# EAGLE board UhrV1.1 (EAGLE 5.11), part 1 of 2
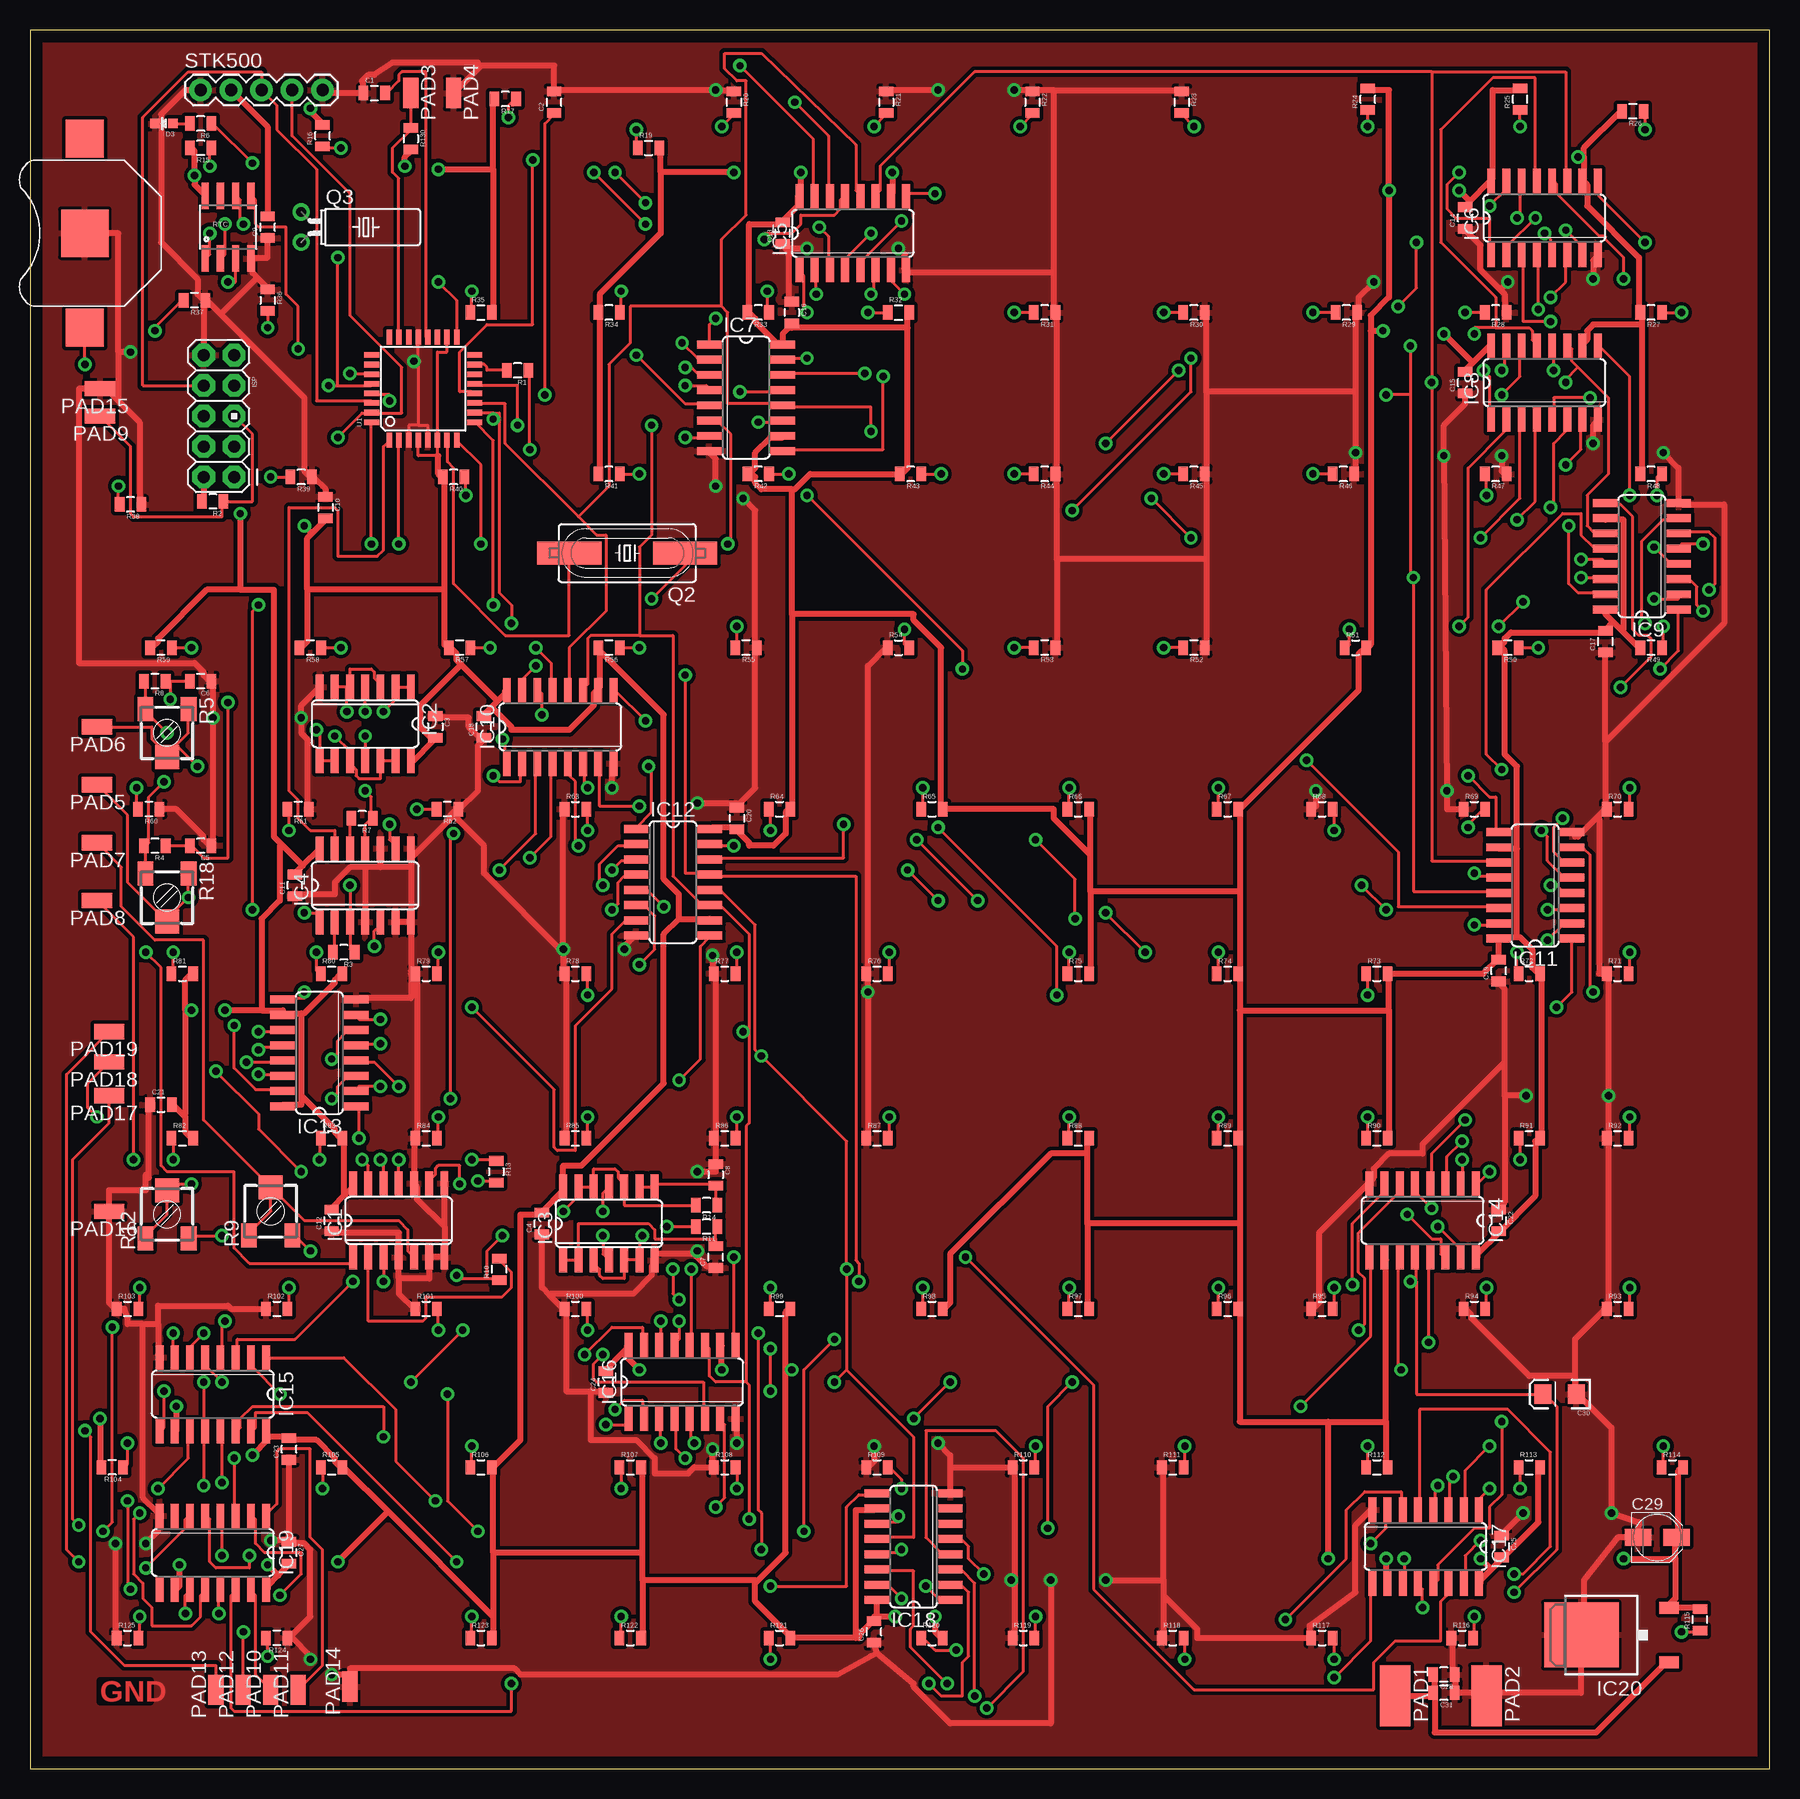
[diagram p3: board, top side]
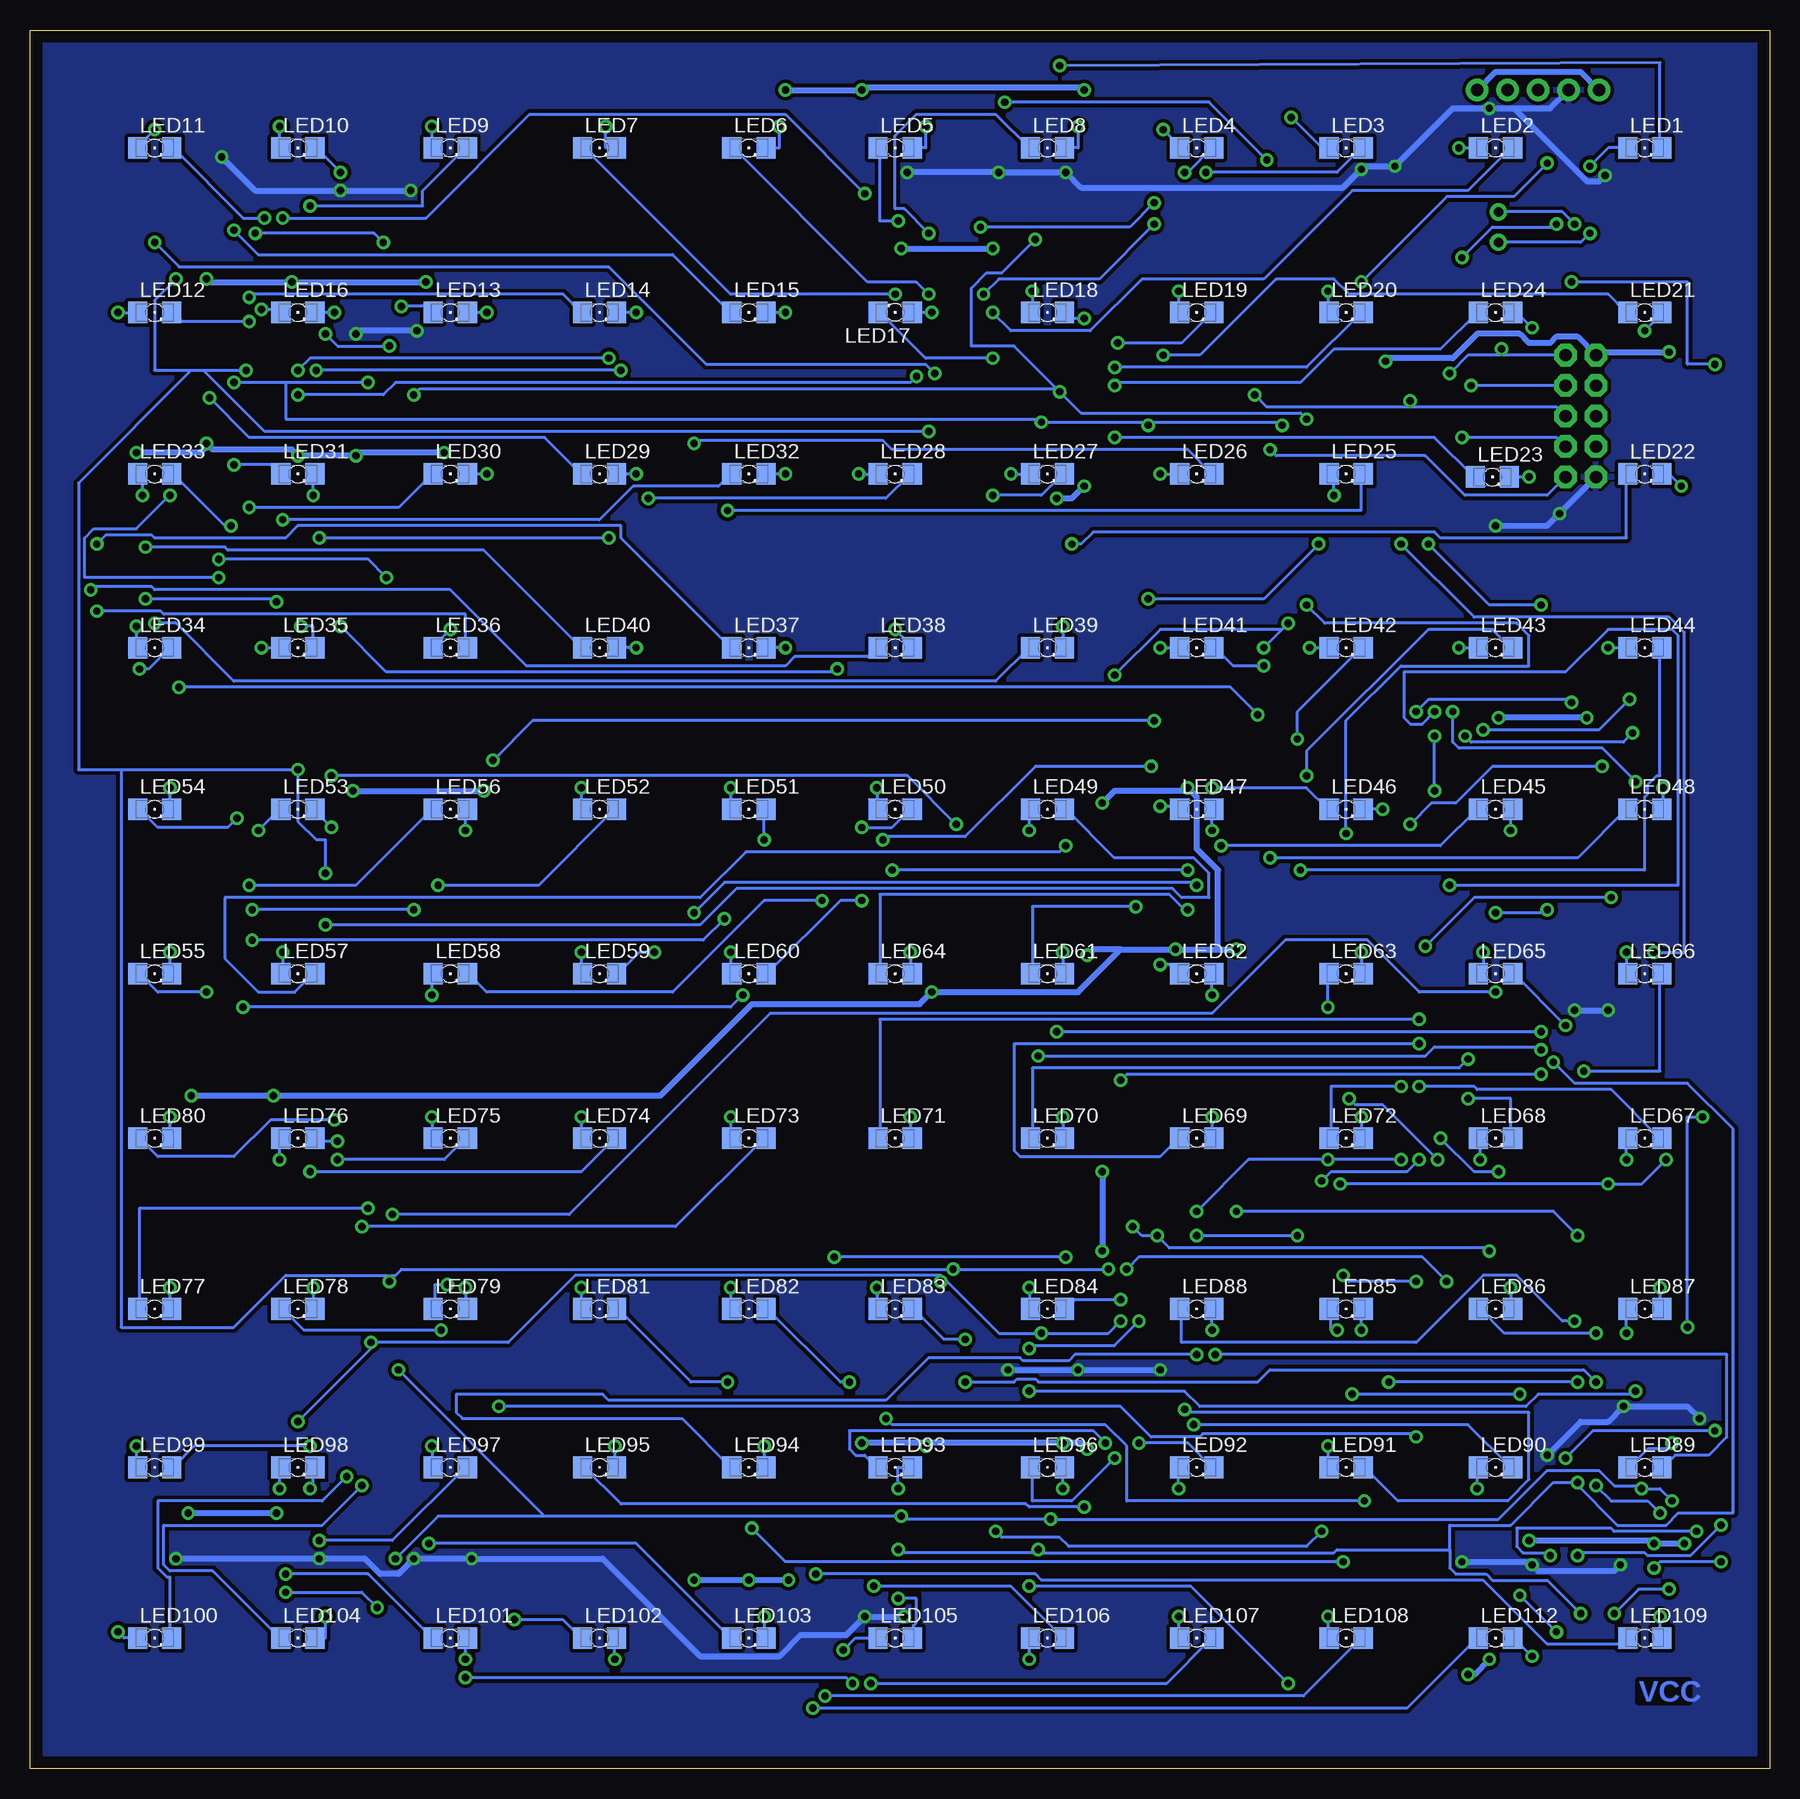
[diagram p4: board, bottom side, seen from below]

Size 145.01 x 144.96 mm. Coordinates in mm from the lower left corner, seen from the top.
Outline: 0,0 145.01,0 145.01,144.96 0,144.96 0,0
Copper layers (1*16): Top 0.035mm / dielectric 1.5mm / Bottom 0.035mm
Design rules "default *": minimum track width 10mil, minimum drill 24mil, track to track 10mil, track to pad 10mil, pad to pad 10mil, via to via 10mil, smd to smd 10mil, copper to edge 40mil, drill to drill 8mil, minimum pad ring 12mil, minimum via ring 10mil, stop-mask expansion 4mil, vias tented up to drill 0mil, thermal gap 10mil
Net classes: 1 supply: width 0.508 mm

## Footprints (pad centres in the part's own frame; a part is rotated, then mirrored left to right if it is on the bottom)
BATTCON_12MM = smd 3.962 x 3.962: GND 0,0 | smd 3.175 x 3.175: PWR@1 -7.874,0; PWR@2 7.874,0
0805 = smd 0.8 x 1.2: 1 -0.9,0; 2 0.9,0
PANASONIC_B = smd 2.2 x 1.4: + 1.6,0; - -1.6,0
EIA3216 = smd 1.4 x 1.6: A 1.4,0; C -1.4,0
LED-0603 = smd 0.8 x 0.8: A 0,-0.75; C 0,0.75
SO14 = smd 0.66 x 2.032: 1 -3.81,-3.073; 2 -2.54,-3.073; 3 -1.27,-3.073; 4 0,-3.073; 5 1.27,-3.073; 6 2.54,-3.073; 7 3.81,-3.073; 8 3.81,3.073; 9 2.54,3.073; 10 1.27,3.073; 11 0,3.073; 12 -1.27,3.073; 13 -2.54,3.073; 14 -3.81,3.073
SO16 = smd 0.66 x 2.032: 1 -4.445,-3.073; 2 -3.175,-3.073; 3 -1.905,-3.073; 4 -0.635,-3.073; 5 0.635,-3.073; 6 1.905,-3.073; 7 3.175,-3.073; 8 4.445,-3.073; 9 4.445,3.073; 10 3.175,3.073; 11 1.905,3.073; 12 0.635,3.073; 13 -0.635,3.073; 14 -1.905,3.073; 15 -3.175,3.073; 16 -4.445,3.073
DPACK = smd 1 x 1.6: 1 -2.28,-4.8; 3 2.28,-4.8 | smd 5.4 x 6.2: 2 0,2.5
AVR_ICSP = drill 1.016 pad 1.88 octagon: 1 -1.27,5.08; 2 1.27,5.08; 3 -1.27,2.54; 4 1.27,2.54; 5 -1.27,0; 6 1.27,0; 7 -1.27,-2.54; 8 1.27,-2.54; 9 -1.27,-5.08; 10 1.27,-5.08
1206 = smd 1.6 x 1.803: A -1.422,0; C 1.422,0
SMD2,54-5,08 = smd 2.54 x 5.08: 1 0,0
SMD1,27-2,54 = smd 1.27 x 2.54: 1 0,0
HC49UP = smd 5.334 x 1.93: 1 -4.826,0; 2 4.826,0
TC38H = drill 0.813 round: 1 -1.27,0; 2 1.27,0
RTRIM3314J = smd 1.3 x 2: 1 -1.8,-2; 3 1.8,-2 | smd 2 x 2: 2 0,2
SO08 = smd 0.61 x 2.21: 1 -1.905,-2.616; 2 -0.635,-2.616; 3 0.635,-2.616; 4 1.905,-2.616; 5 1.905,2.616; 6 0.635,2.616; 7 -0.635,2.616; 8 -1.905,2.616
1X05 = drill 1.016 pad 1.88 round: 1 0,0; 2 2.54,0; 3 5.08,0; 4 7.62,0; 5 10.16,0
TQFP32-08 = smd 1.27 x 0.46: 1 -4.293,2.8; 2 -4.293,2; 3 -4.293,1.2; 4 -4.293,0.4; 5 -4.293,-0.4; 6 -4.293,-1.2; 7 -4.293,-2; 8 -4.293,-2.8; 17 4.293,-2.8; 18 4.293,-2; 19 4.293,-1.2; 20 4.293,-0.4; 21 4.293,0.4; 22 4.293,1.2; 23 4.293,2; 24 4.293,2.8 | smd 0.46 x 1.27: 9 -2.8,-4.293; 10 -2,-4.293; 11 -1.2,-4.293; 12 -0.4,-4.293; 13 0.4,-4.293; 14 1.2,-4.293; 15 2,-4.293; 16 2.8,-4.293; 25 2.8,4.293; 26 2,4.293; 27 1.2,4.293; 28 0.4,4.293; 29 -0.4,4.293; 30 -1.2,4.293; 31 -2,4.293; 32 -2.8,4.293

## Placement (x,y rotation side)
BAT1  [BATTCON_12MM]  4.57,128.02 90 top
C1  0.1uF  [0805]  28.7,139.7 0 top
C2  0.1uF  [0805]  43.69,138.94 90 top
C3  0.1uF  [0805]  33.78,86.87 270 top
C4  0.1uF  [0805]  42.67,45.47 90 top
C5  3,3nF  [0805]  14.22,76.96 180 top
C6  3,3nF  [0805]  14.22,90.68 180 top
C7  3,3nF  [0805]  57.15,42.67 90 top
C8  3,3nF  [0805]  57.15,49.53 270 top
C9  0.1uF  [0805]  19.81,128.52 90 top
C10  0.1uF  [0805]  24.64,105.16 270 top
C11  0.1uF  [0805]  22.1,73.66 90 top
C12  0.1uF  [0805]  25.15,45.72 90 top
C13  0.1uF  [0805]  62.74,128.02 90 top
C14  0.1uF  [0805]  119.63,129.29 90 top
C15  0.1uF  [0805]  119.63,115.57 90 top
C16  0.1uF  [0805]  63.5,121.41 270 top
C17  0.1uF  [0805]  131.32,93.98 90 top
C18  0.1uF  [0805]  37.85,86.87 90 top
C19  0.1uF  [0805]  122.43,66.55 90 top
C20  0.1uF  [0805]  58.93,79.25 270 top
C21  0.1uF  [0805]  10.92,55.37 0 top
C22  0.1uF  [0805]  122.43,45.72 270 top
C23  0.1uF  [0805]  21.59,26.67 90 top
C24  0.1uF  [0805]  48.01,32.26 90 top
C25  0.1uF  [0805]  122.68,18.54 270 top
C26  0.1uF  [0805]  70.36,11.43 90 top
C27  0.1uF  [0805]  21.59,18.03 270 top
C28  0.1uF  [0805]  117.86,7.87 180 top
C29  10uF  [PANASONIC_B]  135.64,19.3 0 top
C30  1uF  [EIA3216]  127.51,31.24 180 top
C31  0.1uF  [0805]  117.86,6.35 180 top
D3  Green  [LED-0603]  11.18,137.16 90 top
IC1  4013D  [SO14]  30.73,45.72 0 top
IC2  4093D  [SO14]  27.94,87.12 180 top
IC3  4093D  [SO14]  48.26,45.47 0 top
IC4  4013D  [SO14]  27.94,73.66 0 top
IC5  74HC595D  [SO16]  68.58,128.02 0 top
IC6  74HC595D  [SO16]  126.24,129.29 0 top
IC7  74HC595D  [SO16]  59.69,114.3 270 top
IC8  74HC595D  [SO16]  126.24,115.57 0 top
IC9  74HC595D  [SO16]  134.37,101.09 90 top
IC10  74HC595D  [SO16]  44.2,86.87 0 top
IC11  74HC595D  [SO16]  125.48,73.66 90 top
IC12  74HC595D  [SO16]  53.59,73.91 270 top
IC13  74HC595D  [SO16]  24.13,59.69 90 top
IC14  74HC595D  [SO16]  116.08,45.72 180 top
IC15  74HC595D  [SO16]  15.24,31.24 180 top
IC16  74HC595D  [SO16]  54.36,32.26 0 top
IC17  74HC595D  [SO16]  116.33,18.54 180 top
IC18  74HC595D  [SO16]  73.66,18.54 90 top
IC19  74HC595D  [SO16]  15.24,18.03 180 top
IC20  LP2950  [DPACK]  131.83,11.18 90 top
ISP  M05X2PTH  [AVR_ICSP]  15.75,112.78 180 top
LED1  [1206]  10.41,135.13 0 bottom
LED2  [1206]  22.86,135.13 0 bottom
LED3  [1206]  35.31,135.13 0 bottom
LED4  [1206]  47.75,135.13 0 bottom
LED5  [1206]  72.9,135.13 0 bottom
LED6  [1206]  85.09,135.13 0 bottom
LED7  [1206]  97.54,135.13 0 bottom
LED8  [1206]  60.2,135.13 0 bottom
LED9  [1206]  109.98,135.13 0 bottom
LED10  [1206]  122.68,135.13 0 bottom
LED11  [1206]  134.62,135.13 0 bottom
LED12  [1206]  134.62,121.41 0 bottom
LED13  [1206]  109.98,121.41 0 bottom
LED14  [1206]  97.54,121.41 0 bottom
LED15  [1206]  85.09,121.41 0 bottom
LED16  [1206]  122.68,121.41 0 bottom
LED17  [1206]  72.9,121.41 180 bottom
LED18  [1206]  60.2,121.41 0 bottom
LED19  [1206]  47.75,121.41 0 bottom
LED20  [1206]  35.31,121.41 0 bottom
LED21  [1206]  10.41,121.41 0 bottom
LED22  [1206]  10.41,107.95 0 bottom
LED23  [1206]  23.11,107.7 0 bottom
LED24  [1206]  22.86,121.41 0 bottom
LED25  [1206]  35.31,107.95 0 bottom
LED26  [1206]  47.75,107.95 0 bottom
LED27  [1206]  60.2,107.95 0 bottom
LED28  [1206]  72.9,107.95 0 bottom
LED29  [1206]  97.54,107.95 0 bottom
LED30  [1206]  109.98,107.95 0 bottom
LED31  [1206]  122.68,107.95 0 bottom
LED32  [1206]  85.09,107.95 0 bottom
LED33  [1206]  134.62,107.95 0 bottom
LED34  [1206]  134.62,93.47 0 bottom
LED35  [1206]  122.68,93.47 0 bottom
LED36  [1206]  109.98,93.47 0 bottom
LED37  [1206]  85.09,93.47 0 bottom
LED38  [1206]  72.9,93.47 0 bottom
LED39  [1206]  60.2,93.47 0 bottom
LED40  [1206]  97.54,93.47 0 bottom
LED41  [1206]  47.75,93.47 0 bottom
LED42  [1206]  35.31,93.47 0 bottom
LED43  [1206]  22.86,93.47 0 bottom
LED44  [1206]  10.41,93.47 0 bottom
LED45  [1206]  22.86,80.01 0 bottom
LED46  [1206]  35.31,80.01 0 bottom
LED47  [1206]  47.75,80.01 0 bottom
LED48  [1206]  10.41,80.01 0 bottom
LED49  [1206]  60.2,80.01 0 bottom
LED50  [1206]  72.9,80.01 0 bottom
LED51  [1206]  85.09,80.01 0 bottom
LED52  [1206]  97.54,80.01 0 bottom
LED53  [1206]  122.68,80.01 0 bottom
LED54  [1206]  134.62,80.01 0 bottom
LED55  [1206]  134.62,66.29 0 bottom
LED56  [1206]  109.98,80.01 0 bottom
LED57  [1206]  122.68,66.29 0 bottom
LED58  [1206]  109.98,66.29 0 bottom
LED59  [1206]  97.54,66.29 0 bottom
LED60  [1206]  85.09,66.29 0 bottom
LED61  [1206]  60.2,66.29 0 bottom
LED62  [1206]  47.75,66.29 0 bottom
LED63  [1206]  35.31,66.29 0 bottom
LED64  [1206]  72.9,66.29 0 bottom
LED65  [1206]  22.86,66.29 0 bottom
LED66  [1206]  10.41,66.29 0 bottom
LED67  [1206]  10.41,52.58 0 bottom
LED68  [1206]  22.86,52.58 0 bottom
LED69  [1206]  47.75,52.58 0 bottom
LED70  [1206]  60.2,52.58 0 bottom
LED71  [1206]  72.9,52.58 0 bottom
LED72  [1206]  35.31,52.58 0 bottom
LED73  [1206]  85.09,52.58 0 bottom
LED74  [1206]  97.54,52.58 0 bottom
LED75  [1206]  109.98,52.58 0 bottom
LED76  [1206]  122.68,52.58 0 bottom
LED77  [1206]  134.62,38.35 0 bottom
LED78  [1206]  122.68,38.35 0 bottom
LED79  [1206]  109.98,38.35 0 bottom
LED80  [1206]  134.62,52.58 0 bottom
LED81  [1206]  97.54,38.35 0 bottom
LED82  [1206]  85.09,38.35 0 bottom
LED83  [1206]  72.9,38.35 0 bottom
LED84  [1206]  60.2,38.35 0 bottom
LED85  [1206]  35.31,38.35 0 bottom
LED86  [1206]  22.86,38.35 0 bottom
LED87  [1206]  10.41,38.35 0 bottom
LED88  [1206]  47.75,38.35 0 bottom
LED89  [1206]  10.41,25.15 0 bottom
LED90  [1206]  22.86,25.15 0 bottom
LED91  [1206]  35.31,25.15 0 bottom
LED92  [1206]  47.75,25.15 0 bottom
LED93  [1206]  72.9,25.15 0 bottom
LED94  [1206]  85.09,25.15 0 bottom
LED95  [1206]  97.54,25.15 0 bottom
LED96  [1206]  60.2,25.15 0 bottom
LED97  [1206]  109.98,25.15 0 bottom
LED98  [1206]  122.68,25.15 0 bottom
LED99  [1206]  134.62,25.15 0 bottom
LED100  [1206]  134.62,10.92 0 bottom
LED101  [1206]  109.98,10.92 0 bottom
LED102  [1206]  97.54,10.92 0 bottom
LED103  [1206]  85.09,10.92 0 bottom
LED104  [1206]  122.68,10.92 0 bottom
LED105  [1206]  72.9,10.92 0 bottom
LED106  [1206]  60.2,10.92 0 bottom
LED107  [1206]  47.75,10.92 0 bottom
LED108  [1206]  35.31,10.92 0 bottom
LED109  [1206]  10.41,10.92 0 bottom
LED112  [1206]  22.86,10.92 0 bottom
PAD1  [SMD2,54-5,08]  113.79,6.1 180 top
PAD2  [SMD2,54-5,08]  121.41,6.1 180 top
PAD3  [SMD1,27-2,54]  31.75,139.7 180 top
PAD4  [SMD1,27-2,54]  35.31,139.7 180 top
PAD5  [SMD1,27-2,54]  5.59,82.04 90 top
PAD6  [SMD1,27-2,54]  5.59,86.87 90 top
PAD7  [SMD1,27-2,54]  5.59,77.22 90 top
PAD8  [SMD1,27-2,54]  5.59,72.39 90 top
PAD9  [SMD1,27-2,54]  5.84,112.78 90 top
PAD10  [SMD1,27-2,54]  20.07,6.6 0 top
PAD11  [SMD1,27-2,54]  22.35,6.6 0 top
PAD12  [SMD1,27-2,54]  17.78,6.6 0 top
PAD13  [SMD1,27-2,54]  15.49,6.6 0 top
PAD14  [SMD1,27-2,54]  26.67,6.86 0 top
PAD15  [SMD1,27-2,54]  5.84,115.06 90 top
PAD16  [SMD1,27-2,54]  6.6,46.48 90 top
PAD17  [SMD1,27-2,54]  6.6,56.13 90 top
PAD18  [SMD1,27-2,54]  6.6,58.93 90 top
PAD19  [SMD1,27-2,54]  6.6,61.47 90 top
Q2  16MHz  [HC49UP]  49.78,101.35 180 top
Q3  [TC38H]  22.61,128.52 270 top
R1  4K7  [0805]  40.64,116.59 180 top
R2  10K  [0805]  15.24,105.66 180 top
R3  4K7  [0805]  26.16,68.07 180 top
R4  33K  [0805]  10.41,76.96 180 top
R5  [RTRIM3314J]  11.43,86.36 180 top
R6  330  [0805]  14.22,137.16 180 top
R7  4K7  [0805]  27.69,79.25 180 top
R8  33K  [0805]  10.41,90.68 180 top
R9  [RTRIM3314J]  20.07,46.48 0 top
R10  4K7  [0805]  39.12,41.66 90 top
R11  33K  [0805]  56.39,45.21 180 top
R12  [RTRIM3314J]  11.43,46.23 0 top
R13  4K7  [0805]  38.86,49.78 270 top
R14  33K  [0805]  56.39,46.99 180 top
R15  120  [0805]  14.22,135.13 180 top
R16  120  [0805]  24.38,136.14 90 top
R17  120  [0805]  39.62,139.19 180 top
R18  [RTRIM3314J]  11.43,72.64 180 top
R19  120  [0805]  51.56,135.13 0 top
R20  120  [0805]  58.67,138.94 270 top
R21  120  [0805]  71.37,138.94 270 top
R22  120  [0805]  83.57,138.94 270 top
R23  120  [0805]  96.01,138.94 270 top
R24  120  [0805]  111.51,139.19 90 top
R25  120  [0805]  124.21,139.19 90 top
R26  120  [0805]  133.6,138.18 180 top
R27  120  [0805]  135.13,121.41 180 top
R28  120  [0805]  122.17,121.41 180 top
R29  120  [0805]  109.73,121.41 180 top
R30  120  [0805]  97.03,121.41 180 top
R31  120  [0805]  84.58,121.41 180 top
R32  120  [0805]  72.39,121.41 0 top
R33  120  [0805]  60.71,121.41 180 top
R34  120  [0805]  48.26,121.41 180 top
R35  120  [0805]  37.59,121.41 0 top
R36  120  [0805]  19.81,122.43 270 top
R37  120  [0805]  13.72,122.43 180 top
R38  120  [0805]  8.38,105.41 180 top
R39  120  [0805]  22.61,107.7 180 top
R40  120  [0805]  35.31,107.7 180 top
R41  120  [0805]  48.26,107.95 180 top
R42  120  [0805]  60.71,107.95 180 top
R43  120  [0805]  73.41,107.95 180 top
R44  120  [0805]  84.58,107.95 180 top
R45  120  [0805]  97.03,107.95 180 top
R46  120  [0805]  109.47,107.95 180 top
R47  120  [0805]  122.17,107.95 180 top
R48  120  [0805]  135.13,107.95 180 top
R49  120  [0805]  135.13,93.47 180 top
R50  120  [0805]  123.19,93.47 180 top
R51  120  [0805]  110.49,93.47 0 top
R52  120  [0805]  97.03,93.47 180 top
R53  120  [0805]  84.58,93.47 180 top
R54  120  [0805]  72.39,93.47 0 top
R55  120  [0805]  59.69,93.47 180 top
R56  120  [0805]  48.26,93.47 180 top
R57  120  [0805]  35.81,93.47 180 top
R58  120  [0805]  23.37,93.47 180 top
R59  120  [0805]  10.92,93.47 180 top
R60  120  [0805]  9.91,80.01 180 top
R61  120  [0805]  22.35,80.01 180 top
R62  120  [0805]  34.8,80.01 180 top
R63  120  [0805]  45.47,80.01 0 top
R64  120  [0805]  62.48,80.01 0 top
R65  120  [0805]  75.18,80.01 0 top
R66  120  [0805]  87.38,80.01 0 top
R67  120  [0805]  99.82,80.01 0 top
R68  120  [0805]  107.7,80.01 0 top
R69  120  [0805]  120.4,80.01 0 top
R70  120  [0805]  132.33,80.01 0 top
R71  120  [0805]  132.33,66.29 0 top
R72  120  [0805]  124.97,66.29 0 top
R73  120  [0805]  112.27,66.29 0 top
R74  120  [0805]  99.82,66.29 0 top
R75  120  [0805]  87.38,66.29 0 top
R76  120  [0805]  70.61,66.29 0 top
R77  120  [0805]  57.91,66.29 0 top
R78  120  [0805]  45.47,66.29 0 top
R79  120  [0805]  33.02,66.29 0 top
R80  120  [0805]  25.15,66.29 0 top
R81  120  [0805]  12.7,66.29 0 top
R82  120  [0805]  12.7,52.58 0 top
R83  120  [0805]  25.15,52.58 0 top
R84  120  [0805]  33.02,52.58 0 top
R85  120  [0805]  45.47,52.58 0 top
R86  120  [0805]  57.91,52.58 0 top
R87  120  [0805]  70.61,52.58 0 top
R88  120  [0805]  87.38,52.58 0 top
R89  120  [0805]  99.82,52.58 0 top
R90  120  [0805]  112.27,52.58 0 top
R91  120  [0805]  124.97,52.58 0 top
R92  120  [0805]  132.33,52.58 0 top
R93  120  [0805]  132.33,38.35 0 top
R94  120  [0805]  120.4,38.35 0 top
R95  120  [0805]  107.7,38.35 0 top
R96  120  [0805]  99.82,38.35 0 top
R97  120  [0805]  87.38,38.35 0 top
R98  120  [0805]  75.18,38.35 0 top
R99  120  [0805]  62.48,38.35 0 top
R100  120  [0805]  45.47,38.35 0 top
R101  120  [0805]  33.02,38.35 0 top
R102  120  [0805]  20.57,38.35 0 top
R103  120  [0805]  8.13,38.35 0 top
R104  120  [0805]  6.86,25.15 180 top
R105  120  [0805]  25.15,25.15 0 top
R106  120  [0805]  37.59,25.15 0 top
R107  120  [0805]  50.04,25.15 0 top
R108  120  [0805]  57.91,25.15 0 top
R109  120  [0805]  70.61,25.15 0 top
R110  120  [0805]  82.8,25.15 0 top
R111  120  [0805]  95.25,25.15 0 top
R112  120  [0805]  112.27,25.15 0 top
R113  120  [0805]  124.97,25.15 0 top
R114  120  [0805]  136.91,25.15 0 top
R115  120  [0805]  139.19,12.45 90 top
R116  120  [0805]  119.38,10.92 0 top
R117  120  [0805]  107.7,10.92 0 top
R118  120  [0805]  95.25,10.92 0 top
R119  120  [0805]  82.8,10.92 0 top
R120  120  [0805]  75.18,10.92 0 top
R121  120  [0805]  62.48,10.92 0 top
R122  120  [0805]  50.04,10.92 0 top
R123  120  [0805]  37.59,10.92 0 top
R124  120  [0805]  20.57,10.92 180 top
R125  120  [0805]  8.13,10.92 0 top
R130  330K  [0805]  31.75,135.89 270 top
RTC  DS1307SO8  [SO08]  16.51,128.52 0 top
STK500  [1X05]  14.22,139.95 0 top
U1  ATMEGA328  [TQFP32-08]  32.77,115.06 90 top

## Tracks (layer width: path | path; a pad name or v marks a point on that pad's centre or on a via)
A0
  Top 0.254: PAD3.1 R130.1 31.75,136.65 30.23,135.13 30.23,133.1 30.73,132.59 30.73,119.38 U1.23
AREF
  Top 0.254: C1.2 29.72,139.7 30.73,140.72 30.73,141.22 30.99,141.48 33.02,141.48 33.02,119.38 U1.20
D2  (via drill 0.61)
  Top 0.254: v28.45,102.11 28.45,112.27 U1.32 | v19.05,97.03 18.54,96.52 v18.54,71.63 | v22.86,71.37 24.13,71.37 IC4.1
  Bottom 0.254: v28.45,102.11 23.37,97.03 v19.05,97.03 | v18.54,71.63 18.8,71.37 v22.86,71.37
D3
  Top 0.254: U1.1 29.97,110.74 29.46,110.24 29.46,101.6 28.96,101.09 25.65,101.09 25.65,104.9 25.4,105.16 21.59,105.16 21.59,81.53 22.35,80.77 22.35,79.25 23.37,78.23 25.4,78.23 IC4.13
D4  (via drill 0.61)
  Top 0.254: v30.73,102.11 30.73,110.74 U1.2 | v9.65,68.07 10.92,66.8 10.92,50.29 11.43,49.78 17.02,49.78 17.02,43.43 18.29,42.16 26.92,42.16 IC1.1
  Bottom 0.254: v30.73,102.11 24.64,96.01 8.38,96.01 7.11,94.74 7.11,68.07 v9.65,68.07
D5  (via drill 0.61)
  Top 0.254: v38.61,97.03 38.61,110.74 37.08,112.27 U1.9 | v35.31,77.98 35.05,77.72 v35.05,55.88 | v27.69,50.8 28.19,50.29 IC1.13
  Bottom 0.254: v38.61,97.03 37.08,95.5 21.08,95.5 20.07,94.49 20.07,91.95 30.73,91.95 35.31,87.38 v35.31,77.98 | v35.05,55.88 34.54,55.37 32.26,55.37 v27.69,50.8
D6  (via drill 0.61)
  Top 0.254: 122.17,120.14 124.97,120.14 125.22,119.89 125.22,119.13 125.48,118.87 IC8.13 | 122.17,120.14 122.17,122.68 117.6,127.25 117.6,136.65 121.92,140.97 125.48,140.97 125.48,132.59 IC6.13 | v129.29,100.84 131.06,100.84 131.06,100.58 IC9.13 | IC11.13 122.17,73.15 115.32,73.15 v115.32,99.31 115.06,99.57 115.06,114.55 | 122.17,120.14 120.4,120.14 v120.4,119.63 | v115.06,118.62 115.06,114.55 | 38.61,113.03 39.12,113.03 39.12,98.04 40.13,97.03 v40.13,95.5 | 38.61,113.03 37.08,113.03 U1.10 | v42.16,93.47 43.43,92.2 43.43,90.17 IC10.13 | v54.61,91.19 54.61,74.68 56.64,74.68 IC12.13 56.9,74.42 68.83,74.42 68.83,42.42 69.09,42.16 v69.09,40.64 | v59.18,114.81 62.74,114.81 IC7.13 | v38.61,112.52 38.61,113.03 | v61.21,127.51 61.21,128.02 63.5,128.02 64.26,128.78 64.26,129.54 67.06,129.54 67.56,130.05 67.56,130.81 67.82,131.06 IC5.13 | 115.06,114.55 v113.03,114.55 | v15.75,12.95 15.75,14.73 IC19.13 | v16,23.88 16,27.94 IC15.13 | v72.64,18.29 72.64,18.03 70.61,18.03 IC18.13 | v18.03,58.93 20.83,58.93 IC13.13 | v54.1,37.34 54.1,35.81 53.85,35.56 IC16.13 | v60.71,36.32 60.71,21.59 60.96,21.34 v60.96,18.29 | v116.59,35.56 116.59,42.42 IC14.13 | v122.68,28.96 122.68,22.86 121.67,21.84 121.67,20.07 120.4,20.07 117.35,17.02 117.35,15.75 117.09,15.49 IC17.13
  Bottom 0.254: v115.32,99.31 116.84,100.84 v129.29,100.84 | v120.4,119.63 119.38,118.62 v115.06,118.62 | 40.64,95 v42.16,93.47 | v40.13,95.5 40.64,95 | v54.61,91.19 50.8,95 40.64,95 | v38.61,112.52 39.12,113.03 57.4,113.03 v59.18,114.81 59.44,115.06 | v61.21,127.51 64.01,124.71 65.28,124.71 66.55,123.44 66.55,118.62 62.99,118.62 59.44,115.06 | v113.03,114.55 112.52,115.06 59.44,115.06 | v15.75,12.95 18.54,15.75 23.11,15.75 23.62,16.26 26.16,16.26 26.67,16.76 26.67,18.29 | 26.67,18.29 26.67,20.32 21.59,20.32 18.03,23.88 16.26,23.88 | v72.64,18.29 72.39,18.03 60.96,18.03 | 60.96,18.03 36.32,18.03 36.07,18.29 26.67,18.29 | v18.03,58.93 16.26,57.15 6.86,57.15 3.05,53.34 3.05,21.34 7.62,21.34 8.64,20.32 12.7,20.32 16.26,23.88 | 16.26,23.88 v16,23.88 | v54.1,37.34 55.12,36.32 v60.71,36.32 64.26,36.32 68.83,40.89 | v60.96,18.29 60.96,18.03 | 116.08,35.56 105.16,35.56 99.57,41.15 69.09,41.15 68.83,40.89 | 116.08,35.56 v122.68,28.96 | 116.08,35.56 v116.59,35.56 | v69.09,40.64 68.83,40.89
D7  (via drill 0.61)
  Top 0.254: 45.72,104.39 47.24,102.87 48.01,102.87 48.01,96.52 44.96,93.47 44.96,90.17 IC10.12 | 45.72,104.39 39.62,110.49 39.62,113.79 37.08,113.79 U1.11 | 57.66,121.92 58.17,121.41 58.17,113.79 62.74,113.79 IC7.12 62.99,113.54 70.1,113.54 v70.1,111.51 | 57.66,121.92 50.04,121.92 50.04,118.87 48.26,117.09 48.26,106.93 45.72,104.39 | 57.66,121.92 57.66,127.51 59.69,129.54 59.69,140.72 58.93,140.72 57.91,141.73 57.91,143 60.96,143 68.83,135.38 68.83,131.57 69.09,131.32 IC5.12 | v120.4,74.68 120.4,74.42 122.17,74.42 IC11.12 | v122.68,83.31 121.41,84.58 121.41,98.3 127.76,104.65 129.29,104.65 129.29,102.87 130.3,101.85 131.06,101.85 IC9.12 | v127,116.59 127,118.62 IC8.12 | v132.84,124.21 132.84,125.98 131.32,127.51 131.32,127.76 130.81,127.76 127.25,131.32 127.25,132.08 127,132.33 IC6.12 | 115.57,40.64 115.57,42.42 IC14.12 | 115.57,40.64 115.57,31.24 C30.A 126.24,31.24 127.25,30.23 127.25,18.29 v123.7,14.73 | v116.08,13.46 116.08,14.99 115.82,15.24 IC17.12 | v9.14,21.34 8.64,20.83 8.64,16.26 9.4,15.49 9.4,14.22 10.16,13.46 10.16,11.94 13.46,11.94 14.22,12.7 14.22,14.48 14.48,14.73 IC19.12 | v14.48,23.62 14.48,27.94 IC15.12 14.48,28.19 v14.48,32.26 | v19.05,59.94 19.05,60.2 20.83,60.2 IC13.12 | IC12.12 56.9,73.15 57.66,73.15 60.45,70.36 60.45,59.94 v60.96,59.44 68.07,52.32 v68.07,41.66 68.07,33.27 | 68.07,33.27 73.66,27.69 73.66,19.3 70.61,19.3 IC18.12 | v55.12,41.66 55.12,35.56 IC16.12 | 68.07,33.27 v67.06,32.26 | v115.06,40.64 115.57,40.64
  Bottom 0.254: v120.4,74.68 120.4,77.47 121.16,77.47 122.68,78.99 v122.68,83.31 137.41,83.31 | 131.57,116.59 130.56,116.59 | 130.56,116.59 v127,116.59 | 131.57,116.59 140.97,107.19 140.97,83.31 137.41,83.31 | v132.84,124.21 134.62,122.43 134.62,116.59 131.57,116.59 | v116.08,13.46 117.35,14.73 v123.7,14.73 | v9.14,21.34 10.16,22.35 13.21,22.35 v14.48,23.62 | v19.05,59.94 19.3,60.2 27.94,60.2 28.7,59.44 v60.96,59.44 | v55.12,41.66 v68.07,41.66 114.05,41.66 114.55,41.15 | v14.48,32.26 15.49,33.27 41.66,33.27 42.67,32.26 60.96,32.26 61.21,32.51 62.74,32.51 62.99,32.26 v67.06,32.26 | 114.55,41.15 v115.06,40.64 | 137.41,83.31 137.41,36.83 128.02,36.83 123.7,41.15 114.55,41.15 | v70.1,111.51 125.48,111.51 130.56,116.59
D8  (via drill 0.61)
  Top 0.254: v41.91,134.11 41.91,120.4 38.1,120.4 35.81,118.11 35.81,114.81 36.83,114.81 U1.12 | v63.75,138.94 66.55,136.14 66.55,131.32 IC5.14
  Bottom 0.254: v41.91,134.11 46.74,138.94 v63.75,138.94
D9  (via drill 0.61)
  Top 0.254: 129.03,116.84 131.57,114.3 131.57,107.95 129.79,106.17 129.79,103.63 130.3,103.12 131.06,103.12 IC9.11 | 129.03,116.84 128.52,117.35 128.52,118.36 128.27,118.62 IC8.11 | 116.84,141.48 128.02,141.48 128.02,132.59 IC6.11 | 116.84,141.48 78.74,141.48 70.87,133.6 70.87,131.57 70.61,131.32 IC5.11 | 116.84,141.48 v116.84,115.57 116.84,75.69 122.17,75.69 IC11.11 | 129.03,116.84 128.02,115.82 v128.02,115.57 | v40.64,112.01 40.64,115.32 37.08,115.32 U1.13 | v60.71,112.27 62.74,112.27 IC7.11 | v12.95,12.95 12.95,14.48 13.21,14.73 IC19.11 | v8.38,14.99 8.13,15.24 v8.13,22.35 | v10.67,23.37 13.21,25.91 13.21,27.94 IC15.11 | 59.69,32.26 57.15,32.26 56.64,32.77 56.64,35.05 56.39,35.31 IC16.11 | 59.69,32.26 59.69,53.59 59.94,53.85 59.94,61.47 | 59.94,61.47 59.94,69.6 57.66,71.88 56.9,71.88 IC12.11 56.64,72.14 55.88,72.14 53.59,74.42 53.59,94.49 50.8,94.49 | v19.05,61.47 20.83,61.47 IC13.11 | 59.94,61.47 v59.44,61.47 | 50.8,94.49 46.74,94.49 46.48,94.23 46.48,90.42 46.23,90.17 IC10.11 | v72.39,21.08 72.39,20.57 70.61,20.57 IC18.11 | v59.94,20.83 59.94,32 59.69,32.26 | v114.55,17.53 114.55,15.49 IC17.11 | v114.3,33.27 114.05,33.53 114.05,42.42 IC14.11 | v51.82,112.01 51.82,102.87 50.8,101.85 50.8,94.49
  Bottom 0.254: v116.84,115.57 123.7,115.57 | 123.7,115.57 v128.02,115.57 | v40.64,112.01 40.89,112.27 51.82,112.27 | 51.82,112.27 v60.71,112.27 60.96,112.52 123.7,112.52 123.7,115.57 | v12.95,12.95 10.92,14.99 v8.38,14.99 | v8.13,22.35 9.14,23.37 v10.67,23.37 10.92,23.62 12.95,23.62 14.22,24.89 18.54,24.89 22.61,20.83 v59.94,20.83 72.14,20.83 v72.39,21.08 102.11,21.08 | v59.44,61.47 v19.05,61.47 | v114.55,17.53 111,21.08 102.11,21.08 | 102.11,21.08 v114.3,33.27 | 51.82,112.27 v51.82,112.01
GND  (via drill 0.61)
  Top 0.254: U1.5 33.17,112.01 32.37,112.01 | U1.3 31.57,112.01 32.37,112.01 | 32.37,112.01 32.37,117.35 U1.21
  Top 0.508: R61.1 23.11,80.01 23.11,85.85 22.61,86.36 v22.61,87.63 22.61,88.65 24.13,90.17 IC2.7 | R60.1 12.19,80.01 14.48,77.72 14.48,77.47 14.99,76.96 C5.1 15.24,76.96 v15.24,87.63 15.24,90.68 C6.1 14.99,90.68 14.48,91.19 14.48,91.44 13.72,92.2 4.06,92.2 4.06,115.06 PAD15.1 6.35,115.06 7.24,114.17 | 7.24,114.17 9.14,112.27 9.14,105.41 R38.1 | BAT1.GND 7.37,128.02 7.37,118.11 | 7.37,118.11 7.37,114.3 7.24,114.17 | 18.92,124.33 18.54,124.71 18.54,125.98 | 18.92,124.33 19.81,123.44 R36.1 | 18.54,125.73 RTC.4 18.54,125.98 | 18.54,125.98 19.81,125.98 C9.1 | C10.1 24.64,106.68 23.62,107.7 R39.1 23.37,107.7 22.86,108.2 22.86,114.3 15.88,121.28 | 14.48,122.43 ISP.10 | 15.88,121.28 14.73,122.43 R37.1 14.48,122.43 | 15.88,121.28 18.92,124.33 | v32,117.35 32.37,117.35 | STK500.5 24.38,139.7 C1.1 27.69,140.72 28.19,141.22 28.7,141.22 30.23,142.24 37.34,142.24 37.34,141.99 37.47,141.86 | 10.79,137.29 10.92,137.41 10.92,137.92 12.95,139.95 STK500.1 | 10.79,137.29 10.67,137.16 D3.C | 43.69,139.95 v57.15,139.95 58.67,139.95 R20.1 | 37.47,141.86 37.59,141.99 43.69,141.99 43.69,139.95 | 37.47,141.86 PAD4.1 | 43.69,139.95 C2.2 | 14.48,122.43 13.97,122.94 13.97,124.21 10.92,127.25 10.92,137.16 10.79,137.29 | v8.38,118.11 7.37,118.11 | v75.69,139.95 71.37,139.95 R21.1 | 83.57,139.95 v82.04,139.95 | 85.34,139.95 83.57,139.95 | 85.34,139.95 96.01,139.95 R23.1 | 83.57,139.95 R22.1 | C16.1 63.5,122.43 63.25,122.68 63.25,126.49 62.74,127 C13.1 63.25,126.75 v64.77,126.75 | 85.6,100.84 85.6,107.95 | 85.6,100.84 85.6,93.47 R53.1 | 85.6,107.95 85.6,121.41 R31.1 85.34,121.41 85.34,124.71 | 85.6,107.95 R44.1 | 85.34,124.71 73.15,124.71 IC5.8 72.9,124.97 72.9,126.24 v72.39,126.75
  Top 0.508: 85.34,124.71 85.34,139.95 | v107.19,81.53 107.19,80.26 106.93,80.01 R68.1 | R69.1 118.11,80.01 v118.11,81.53 v117.86,109.47 117.86,112.01 119.63,113.79 C15.1 | v122.68,109.47 122.68,108.2 122.94,107.95 R47.1 | v130.3,110.49 130.3,112.01 130.56,112.27 IC8.8 | 122.56,123.32 122.94,122.94 122.94,121.41 R28.1 | 122.56,123.32 120.9,124.97 120.9,127 119.63,128.27 C14.1 | v130.3,124.21 130.3,125.73 130.56,125.98 IC6.8 | v123.19,123.95 122.56,123.32 | 110.49,114.81 110.49,121.41 R29.1 110.74,121.41 110.74,122.68 v112.01,123.95 | 110.49,114.81 v110.49,109.73 110.49,107.95 R46.1 | 98.04,107.95 98.04,100.84 | 98.04,100.84 98.04,93.47 R52.1 | 98.04,114.81 98.04,107.95 | 98.04,114.81 98.04,121.41 R30.1 | 98.04,107.95 R45.1 | 110.49,114.81 98.04,114.81 | 98.04,100.84 85.6,100.84 | 21.59,19.05 C23.1 | v7.11,18.8 7.11,10.92 R125.1 | v9.65,18.8 10.67,19.81 10.67,21.08 IC19.8 10.67,21.34 9.4,22.61 9.4,37.08 | 10.67,37.08 10.67,34.54 IC15.8 | 10.67,37.08 10.67,38.61 16.51,38.61 16.76,38.35 R102.1 | C21.1 9.91,55.37 9.91,49.28 9.65,49.28 | 9.4,37.08 8.13,37.08 8.13,37.59 7.87,38.35 R103.1 7.11,38.35 6.6,38.86 PAD16.1 6.6,48.26 9.65,48.26 9.65,49.28 | 9.4,37.08 10.67,37.08 | 21.59,19.05 v20.07,19.05 | 21.59,19.05 C27.1 21.59,18.8 22.86,18.8 23.37,18.29 23.37,12.7 21.59,10.92 R124.1 21.84,10.92 23.37,9.4 v23.37,9.14 | 70.61,9.65 70.1,9.4 67.31,7.87 40.89,7.87 40.39,8.38 26.67,8.38 26.67,7.87 | 55.5,42.8 55.37,42.93 52.07,42.93 IC3.7 52.07,42.16 51.82,41.91 51.82,41.15 50.29,39.62 43.43,39.62 43.31,39.5 | 55.5,42.8 56.39,41.91 57.15,41.91 C7.1 | 43.31,39.5 42.67,40.13 C4.1 | 43.31,39.5 44.45,38.35 R100.1 44.7,38.35 44.7,31.5 46.74,31.5
  Top 0.508: 46.74,31.5 48.01,31.5 C24.1 | 56.9,25.15 55.37,25.15 54.86,24.64 52.07,24.64 52.07,25.91 50.55,27.43 46.74,27.43 46.74,31.5 | 94.49,15.75 94.49,25.15 R111.1 | 94.49,15.75 94.49,14.48 | 94.49,14.48 94.49,10.92 R118.1 | 94.49,14.48 97.28,11.68 97.28,10.92 R117.1 106.68,11.18 106.68,11.94 110.49,14.73 110.49,20.32 111.76,21.59 IC17.8 | 82.04,15.75 82.04,25.15 R110.1 76.71,25.15 | 82.04,15.75 82.04,10.92 R119.1 | v70.36,26.92 70.36,25.65 69.85,25.15 R109.1 | v75.69,27.18 76.71,26.16 76.71,25.15 | 76.71,25.15 76.71,23.11 IC18.8 | v58.93,27.18 58.93,28.96 IC16.8 | v89.66,15.75 94.49,15.75 | 82.04,15.75 v81.79,15.75 | 56.9,25.15 v56.9,26.67 | 56.9,25.15 R108.1 | 70.61,9.65 73.66,7.11 73.66,6.86 76.71,3.81 85.09,3.81 v85.09,15.75 | 70.61,9.65 C26.1 | 26.67,7.87 v25.15,7.87 | 26.67,7.87 PAD14.1 | 30.73,40.89 30.73,39.62 32,38.35 R101.1 | 30.73,40.89 IC1.4 30.73,44.7 25.15,44.7 C12.1 | 34.54,42.67 33.27,42.67 IC1.6 33.27,40.89 30.73,40.89 | 34.54,45.21 34.54,42.67 | 34.54,45.21 IC1.8 | 34.54,42.67 IC1.7 | 34.54,45.21 32.26,47.5 32.26,48.51 32,48.77 IC1.10 32,52.58 R84.1 32.26,52.58 32.26,66.29 R79.1 | 29.21,75.18 27.94,75.18 | 27.94,75.18 26.67,75.18 25.4,73.91 25.4,72.9 22.1,72.9 C11.1 | 29.21,75.18 IC4.10 | 27.94,75.18 IC4.4 | R62.1 35.81,80.01 37.34,81.53 37.34,85.34 37.85,85.85 C18.1 37.59,85.85 36.58,86.87 36.58,87.63 33.78,87.63 C3.1 | R79.1 32,66.29 31.75,66.55 IC4.7 31.75,70.61 | IC13.8 27.43,64.26 31.75,64.26 31.75,66.29 R79.1 | 31.75,70.61 30.48,70.61 IC4.6 | 31.75,75.18 31.75,70.61 | 31.75,75.95 31.75,75.18 | 31.75,75.95 35.05,79.25 35.05,79.5 35.56,80.01 R62.1 | 31.75,75.95 IC4.8 | 31.75,75.18 29.21,75.18
  Top 0.508: 69.85,66.29 v69.85,64.77 69.85,52.58 R87.1 | 69.85,66.29 69.85,91.95 71.37,93.47 R54.1 | 69.85,66.29 R76.1 | 60.45,93.47 60.45,81.79 58.93,80.26 C20.1 58.93,80.52 v55.63,80.52 | v57.15,106.93 57.15,109.22 56.64,109.73 IC7.8 | v59.44,105.92 60.45,104.9 60.45,93.47 | 60.45,93.47 R55.1 | 57.15,52.58 C8.1 57.15,49.78 v55.63,49.78 | 57.15,52.58 57.15,66.29 R77.1 56.9,66.29 v56.9,67.82 | 57.15,52.58 R86.1 | R85.1 44.7,52.58 44.7,66.29 R78.1 44.45,66.29 44.45,68.07 | R63.1 44.45,80.01 v44.45,68.33 44.45,68.07 | v49.53,68.33 49.53,68.58 50.29,69.34 IC12.8 | v48.51,81.79 48.51,83.57 IC10.8 | 44.45,68.07 37.85,74.68 37.85,76.96 35.31,79.5 R62.1 | 128.78,32.77 124.97,32.77 120.14,37.59 120.14,37.85 119.63,38.35 R94.1 | 128.78,32.77 128.78,31.24 C30.C 129.03,31.24 131.83,28.45 v131.83,21.34 134.11,20.57 C29.- 132.33,19.3 129.54,15.75 129.54,11.18 IC20.2 129.29,11.18 129.29,6.35 121.41,6.35 | 128.78,32.77 128.78,35.81 131.32,38.35 R93.1 131.57,38.35 131.57,52.58 | v124.46,21.34 122.68,19.56 C25.1 | 118.87,6.35 118.87,7.87 C28.1 118.62,8.13 118.62,10.92 R116.1 | 121.41,6.35 118.87,6.35 | 118.87,6.35 C31.1 | 121.41,6.35 PAD2.1 | R95.1 106.93,38.35 107.44,38.86 107.44,44.7 111.51,48.77 IC14.8 111.76,49.02 112.01,49.28 112.01,50.04 113.28,51.31 116.08,51.31 116.08,52.07 122.94,58.93 | 122.94,58.93 122.94,65.02 122.43,65.53 C19.1 | 122.94,56.13 122.94,58.93 | 122.94,56.13 122.94,47.24 122.43,46.74 C22.1 | 131.57,52.58 v131.57,56.13 131.57,66.29 R71.1 130.81,66.29 130.81,79.25 130.68,79.38 | 130.68,79.38 129.03,77.72 128.78,77.72 128.78,77.98 IC11.8 | 131.32,80.01 130.68,79.38 | 131.32,85.6 131.32,80.01
  Top 0.508: 131.32,85.6 C17.1 | 131.32,80.01 R70.1 | 131.32,85.6 141.22,95.5 141.22,105.41 137.67,105.41 IC9.8 137.41,105.66 137.41,108.46 v136.14,109.73 | v124.71,56.13 122.94,56.13 | 131.57,52.58 R92.1 | v55.63,43.18 55.63,42.93 55.5,42.8 | 9.65,49.28 9.65,49.53
  Bottom 0.508: v15.24,87.63 v22.61,87.63 | v32,117.35 31.75,117.6 26.42,117.6 24.38,119.63 20.83,119.63 20.07,118.87 18.29,118.87 17.78,119.38 16,119.38 ISP.10 14.48,118.11 v8.38,118.11 | STK500.5 22.86,141.48 15.75,141.48 STK500.1 | v82.04,139.95 v75.69,139.95 75.44,140.21 57.4,140.21 v57.15,139.95 | v72.39,126.75 v64.77,126.75 | v118.11,81.53 v107.19,81.53 | v130.3,124.21 130.05,123.95 v123.19,123.95 v112.01,123.95 | v110.49,109.73 117.6,109.73 v117.86,109.47 v122.68,109.47 123.19,109.98 129.79,109.98 v130.3,110.49 130.3,110.24 130.81,109.73 v136.14,109.73 | v7.11,18.8 v9.65,18.8 9.91,19.05 v20.07,19.05 | v75.69,27.18 70.61,27.18 v70.36,26.92 70.36,27.18 v58.93,27.18 57.4,27.18 v56.9,26.67 | v81.79,15.75 v85.09,15.75 v89.66,15.75 | v23.37,9.14 24.64,7.87 v25.15,7.87 | v57.15,106.93 58.17,105.92 v59.44,105.92 | 45.97,68.33 v44.45,68.33 | 45.97,68.33 v49.53,68.33 54.1,68.33 | 45.97,68.33 45.97,74.93 47.75,76.71 47.75,81.03 v48.51,81.79 48.51,81.53 54.61,81.53 v55.63,80.52 | v56.9,67.82 56.39,68.33 54.1,68.33 | 54.1,68.33 57.66,64.77 v69.85,64.77 70.87,63.75 84.84,63.75 92.46,56.13 v124.71,56.13 v131.57,56.13 | v131.83,21.34 v124.46,21.34 | v55.63,49.78 v55.63,43.18
  pour Top (isolate 0.305): 0,145.03 145.03,145.03 145.03,0 0,0
MOSI
  Top 0.254: R1.2 38.1,116.59 38.1,116.84 37.85,117.09 37.08,117.09 U1.15
N$1  (via drill 0.61)
  Top 0.254: v37.59,102.11 37.59,108.71 35.56,110.74 U1.8 | v51.82,97.54 54.61,100.33 Q2.1
  Bottom 0.254: v37.59,102.11 42.16,97.54 v51.82,97.54
N$2
  Top 0.254: Q2.2 44.96,94.49 39.62,94.49 35.31,98.81 35.31,108.46 34.8,108.97 34.8,110.74 U1.7
N$3  (via drill 0.61)
  Top 0.254: v41.66,109.98 41.66,116.59 R1.1
  Bottom 0.254: v41.66,109.98 41.15,109.47 28.7,109.47 25.4,106.17 18.54,106.17 ISP.1
N$4  (via drill 0.61)
  Top 0.254: v16.26,128.78 16.26,126.24 16,125.98 RTC.2
  Bottom 0.254: v16.26,128.78 17.27,129.79 Q3.1
N$5  (via drill 0.61)
  Top 0.254: v14.99,128.02 14.99,126.24 14.73,125.98 RTC.1
  Bottom 0.254: v14.99,128.02 15.75,127.25 Q3.2
N$6  (via drill 0.61)
  Top 0.254: RTC.3 17.14,123.95 v16.51,123.95 | v4.57,117.09 BAT1.PWR@1
  Bottom 0.254: v16.51,123.95 6.86,123.95 6.86,117.09 v4.57,117.09
N$7
  Top 0.254: D3.A R6.2
N$8  (via drill 0.61)
  Top 0.254: R3.1 26.92,68.07 26.67,68.33 IC4.3 v26.67,73.66 | v27.94,88.14 IC2.4
  Bottom 0.254: v27.94,88.14 28.96,87.12 29.97,87.12 30.48,87.63 30.48,91.44 17.02,91.44 13.46,95 8.13,95 7.62,94.49 7.62,73.66 v26.67,73.66
N$9
  Top 0.254: R3.2 25.4,68.07 IC4.2
N$10  (via drill 0.61)
  Top 0.254: v14.99,133.6 14.99,135.13 R15.1
  Bottom 0.254: v14.99,133.6 13.46,135.13 LED1.A
N$11  (via drill 0.61)
  Top 0.254: 9.65,76.96 9.65,74.68 R18.3 | 26.42,90.17 26.67,90.17 IC2.5 | 26.42,90.17 25.4,90.17 IC2.6 | IC2.3 29.21,90.42 28.7,90.93 28.7,91.44 28.45,91.69 26.67,91.69 IC2.5 | 9.65,76.96 9.91,77.22 9.91,81.03 v11.18,82.3 | v26.42,88.14 26.42,90.17 | 9.65,76.96 R4.2 | 26.42,90.17 IC2.5
  Bottom 0.254: v11.18,82.3 13.97,85.09 25.91,85.09 26.42,85.6 v26.42,88.14
N$12  (via drill 0.61)
  Top 0.254: 38.1,40.89 35.56,40.89 v35.56,41.15 | 38.1,40.89 39.12,40.89 R10.1 | IC1.3 v29.46,40.64 | v47.75,44.45 47.75,42.93 48.26,42.42 IC3.4 | v39.37,44.45 38.1,43.18 38.1,40.89
  Bottom 0.254: v35.56,41.15 35.05,40.64 v29.46,40.64 | v39.37,44.45 v47.75,44.45
N$13  (via drill 0.61)
  Top 0.254: R4.1 C5.2 13.46,76.96 14.48,75.95 16.51,75.95 v16.51,88.9 | v29.46,88.14 30.48,89.15 30.48,90.17 | 30.48,90.17 31.75,90.17 IC2.1 | 30.48,90.17 IC2.2
  Bottom 0.254: v16.51,88.9 16.76,89.15 28.45,89.15 v29.46,88.14
N$14  (via drill 0.61)
  Top 0.254: v22.86,64.77 22.86,64.26 21.08,64.26 IC13.9 | v114.81,46.23 116.84,44.2 117.6,44.2 117.6,42.93 117.86,42.67 IC14.14
  Bottom 0.254: v22.86,64.77 29.21,64.77 33.53,69.09 40.39,69.09 46.48,62.99 83.31,62.99 100.08,46.23 v114.81,46.23
N$15  (via drill 0.61)
  Top 0.254: 28.45,79.25 27.94,78.74 IC4.11 | v27.94,81.53 28.45,81.03 28.45,79.25 | v27.94,86.11 IC2.11 | 28.45,79.25 R7.1
  Bottom 0.254: v27.94,81.53 v27.94,86.11
N$16
  Top 0.254: R7.2 26.67,79.25 IC4.12
N$17  (via drill 0.61)
  Top 0.254: R8.2 9.65,90.68 9.65,88.39 R5.3 9.65,88.14 v11.43,86.36 | IC2.13 30.48,84.07 29.21,84.07 IC2.12 29.21,82.55 27.43,82.55 27.18,82.8 27.18,83.31 26.67,83.82 IC2.10 26.67,84.84 v25.4,86.11
  Bottom 0.254: v11.43,86.36 12.19,85.6 24.89,85.6 v25.4,86.11
N$18  (via drill 0.61)
  Top 0.254: 11.68,90.68 R8.1 11.43,90.68 | 11.68,90.68 C6.2 | 11.68,90.68 v11.68,89.15 | v23.88,86.61 24.13,86.36 24.13,84.07 | 24.13,84.07 25.4,84.07 IC2.9 | 24.13,84.07 IC2.8
  Bottom 0.254: v11.68,89.15 14.22,86.61 v23.88,86.61
N$19  (via drill 0.61)
  Top 0.254: v25.91,135.13 24.38,135.13 R16.1
  Bottom 0.254: v25.91,135.13 LED2.A
N$20
  Top 0.254: PAD10.1 18.8,7.87 18.8,14.48 18.54,14.73 IC19.15
N$21
  Top 0.254: R10.2 39.12,42.42 40.13,41.4 40.13,40.13 39.37,39.37 33.02,39.37 33.02,37.59 32.77,37.34 28.19,37.34 IC1.2
N$22  (via drill 0.61)
  Top 0.254: IC3.3 46.99,42.16 47.5,41.66 47.5,41.15 47.75,40.89 49.53,40.89 IC3.5 49.53,42.42 50.8,42.42 | v51.05,44.45 50.8,44.2 50.8,42.42 | v53.09,45.21 R11.2 | v23.37,43.18 22.1,44.45 R9.3 | 50.8,42.42 IC3.6
  Bottom 0.254: v53.09,45.21 52.32,44.45 v51.05,44.45 50.04,43.43 23.62,43.43 v23.37,43.18
N$23
  Top 0.254: 57.15,44.2 57.15,45.21 R11.1 | 57.15,44.2 C7.2 | 57.15,44.2 52.07,44.2 52.07,44.96 51.56,45.47 45.72,45.47 45.72,42.42 | 45.72,42.42 44.45,42.42 IC3.1 | 45.72,42.42 IC3.2
N$24  (via drill 0.61)
  Top 0.254: v39.88,137.67 39.88,138.68 40.39,139.19 R17.1
  Bottom 0.254: v39.88,137.67 37.34,135.13 LED3.A
N$25
  Top 0.254: PAD11.1 24.38,8.64 24.38,18.29 23.37,19.3 23.37,26.67 20.83,26.67 20.57,26.42 20.57,22.1 19.81,21.34 IC19.1
N$26  (via drill 0.61)
  Top 0.254: v36.83,50.8 38.86,50.8 R13.1 | IC1.11 v30.73,50.8 | v47.75,46.48 47.75,48.01 48.26,48.51 IC3.11
  Bottom 0.254: v30.73,50.8 v36.83,50.8 43.43,50.8 v47.75,46.48
N$27  (via drill 0.61)
  Top 0.254: v37.34,49.02 38.86,49.02 R13.2 | v29.21,50.8 29.46,50.55 IC1.12
  Bottom 0.254: v37.34,49.02 36.58,49.78 30.23,49.78 v29.21,50.8
N$28  (via drill 0.61)
  Top 0.254: R14.2 49.53,46.99 IC3.10 49.53,48.77 49.02,49.28 49.02,49.78 48.77,50.04 46.99,50.04 IC3.12 46.99,48.51 45.72,48.51 | v16,44.45 13.46,44.45 R12.3 | v44.45,46.48 45.72,47.75 45.72,48.51 | 45.72,48.51 IC3.13
  Bottom 0.254: v16,44.45 18.03,46.48 v44.45,46.48
N$29
  Top 0.254: R14.1 57.15,46.99 C8.2 57.15,48.77 52.07,48.77 IC3.8 52.07,48.51 50.8,48.51 IC3.9
N$30  (via drill 0.61)
  Top 0.254: v50.55,136.65 50.55,135.13 R19.1
  Bottom 0.254: v50.55,136.65 49.02,135.13 LED4.A
N$31  (via drill 0.61)
  Top 0.254: v20.83,14.48 22.61,16.26 22.61,18.03 19.56,18.03 18.8,18.8 18.8,20.83 18.54,21.08 IC19.2 | PAD12.1 v17.78,11.43
  Bottom 0.254: v17.78,11.43 v20.83,14.48
N$32  (via drill 0.61)
  Top 0.254: v57.66,136.91 58.67,137.92 R20.2
  Bottom 0.254: v57.66,136.91 57.66,135.13 LED8.C
N$33  (via drill 0.61)
  Top 0.254: v70.36,136.91 71.37,137.92 R21.2
  Bottom 0.254: v70.36,136.91 70.36,135.13 LED5.C
N$34  (via drill 0.61)
  Top 0.254: v82.55,136.91 83.57,137.92 R22.2
  Bottom 0.254: v82.55,136.91 82.55,135.13 LED6.C
N$35  (via drill 0.61)
  Top 0.254: v97.03,136.91 96.01,137.92 R23.2
  Bottom 0.254: v97.03,136.91 97.03,135.13 LED7.C
N$36  (via drill 0.61)
  Top 0.254: v59.18,141.99 65.28,135.89 65.28,131.32 IC5.15
  Bottom 0.254: v59.18,141.99 9.14,142.24 9.14,135.13 LED1.C
N$37  (via drill 0.61)
  Top 0.254: v64.77,121.41 64.52,121.67 64.52,124.46 64.26,124.71 IC5.1
  Bottom 0.254: v64.77,121.41 63.25,119.89 56.64,119.89 52.32,124.21 42.16,124.21 34.8,131.57 25.15,131.57 21.59,135.13 LED2.C
N$38  (via drill 0.61)
  Top 0.254: v46.99,133.1 v51.31,128.78 | v65.53,122.94 65.53,124.71 IC5.2
  Bottom 0.254: v46.99,133.1 36.07,133.1 34.04,135.13 LED3.C | v51.31,128.78 55.88,124.21 64.26,124.21 v65.53,122.94
N$39  (via drill 0.61)
  Top 0.254: v48.77,133.1 v51.31,130.56 | v65.79,128.52 66.55,127.76 66.55,124.97 IC5.3
  Bottom 0.254: v48.77,133.1 48.51,133.1 46.48,135.13 LED4.C | v51.31,130.56 53.34,128.52 v65.79,128.52
N$40  (via drill 0.61)
  Top 0.254: v70.1,128.02 68.07,125.98 68.07,124.97 IC5.4
  Bottom 0.254: v70.1,128.02 72.14,130.05 72.9,130.05 72.9,136.14 71.12,137.92 64.52,137.92 61.72,135.13 LED8.A
N$41  (via drill 0.61)
  Top 0.254: v72.64,129.03 69.34,125.73 69.34,124.97 IC5.5
  Bottom 0.254: v72.64,129.03 74.17,129.03 74.17,135.13 LED5.A
N$42  (via drill 0.61)
  Top 0.254: v70.1,122.94 70.36,123.19 70.36,124.71 IC5.6
  Bottom 0.254: v70.1,122.94 71.12,123.95 75.18,123.95 86.36,135.13 LED6.A
N$43  (via drill 0.61)
  Top 0.254: v72.9,122.94 71.88,123.95 71.88,124.71 IC5.7
  Bottom 0.254: v72.9,122.94 86.61,122.94 98.81,135.13 LED7.A
N$44  (via drill 0.61)
  Top 0.254: v17.02,25.91 17.02,21.34 IC19.3 | v4.57,28.19 5.08,27.69 5.08,11.43 7.87,8.64 15.49,8.64 PAD13.1
  Bottom 0.254: v17.02,25.91 14.73,28.19 v4.57,28.19
N$45  (via drill 0.61)
  Top 0.254: v111.51,136.91 R24.1
  Bottom 0.254: v111.51,136.91 111.51,135.13 LED9.A
N$46  (via drill 0.61)
  Top 0.254: v124.21,136.91 R25.1
  Bottom 0.254: v124.21,136.91 124.21,135.13 LED10.A
N$47  (via drill 0.61)
  Top 0.254: v134.62,136.65 134.62,138.18 R26.1
  Bottom 0.254: v134.62,136.65 136.14,135.13 LED11.A
N$48  (via drill 0.61)
  Top 0.254: R27.1 v137.67,121.41
  Bottom 0.254: v137.67,121.41 LED12.A
N$49  (via drill 0.61)
  Top 0.254: R28.2 v119.63,121.41
  Bottom 0.254: v119.63,121.41 LED16.C
N$50  (via drill 0.61)
  Top 0.254: R29.2 v106.93,121.41
  Bottom 0.254: v106.93,121.41 LED13.C
N$51  (via drill 0.61)
  Top 0.254: R30.2 v94.49,121.41
  Bottom 0.254: v94.49,121.41 LED14.C
N$52  (via drill 0.61)
  Top 0.254: R31.2 v82.04,121.41
  Bottom 0.254: v82.04,121.41 LED15.C
N$53  (via drill 0.61)
  Top 0.254: v121.67,130.3 122.94,131.57 122.94,132.33 IC6.15
  Bottom 0.254: v121.67,130.3 112.27,130.3 112.27,131.57 108.71,135.13 LED9.C
N$54  (via drill 0.61)
  Top 0.254: v119.13,133.1 118.11,132.08 118.11,130.05 118.87,129.29 121.67,129.29 121.67,126.24 IC6.1
  Bottom 0.254: v119.13,133.1 121.16,135.13 LED10.C
N$55  (via drill 0.61)
  Top 0.254: v125.48,129.29 123.19,127 123.19,126.24 IC6.2
  Bottom 0.254: v125.48,129.29 127.25,129.29 133.1,135.13 LED11.C
N$56  (via drill 0.61)
  Top 0.254: v126.75,120.65 124.46,120.65 124.46,125.98 IC6.3
  Bottom 0.254: v126.75,120.65 132.33,120.65 133.1,121.41 LED12.C
N$57  (via drill 0.61)
  Top 0.254: v125.73,121.67 125.73,125.98 IC6.4
  Bottom 0.254: v125.73,121.67 124.46,121.67 124.21,121.41 LED16.A
N$58  (via drill 0.61)
  Top 0.254: v114.05,121.92 115.57,123.44 v115.57,127.25 | v126.24,128.02 126.75,127.51 126.75,126.24 IC6.5
  Bottom 0.254: v114.05,121.92 112.01,121.92 111.51,121.41 LED13.A | v115.57,127.25 116.33,128.02 v126.24,128.02
N$59  (via drill 0.61)
  Top 0.254: v126.75,122.68 128.02,123.95 128.02,125.98 IC6.6
  Bottom 0.254: v126.75,122.68 126.49,122.94 100.58,122.94 99.06,121.41 LED14.A
N$60  (via drill 0.61)
  Top 0.254: v128.02,128.27 129.29,127 129.29,126.24 IC6.7
  Bottom 0.254: v128.02,128.27 125.98,126.24 91.44,126.24 86.61,121.41 LED15.A
N$61  (via drill 0.61)
  Top 0.254: v75.44,131.32 73.15,131.32 IC5.9 | v123.95,129.29 124.21,129.54 124.21,132.33 IC6.14
  Bottom 0.254: v75.44,131.32 82.04,137.92 103.38,137.92 112.01,129.29 v123.95,129.29
N$62  (via drill 0.61)
  Top 0.254: v69.85,121.41 R32.1
  Bottom 0.254: v69.85,121.41 LED17.A
N$63  (via drill 0.61)
  Top 0.254: v61.47,123.19 61.47,121.41 R33.1
  Bottom 0.254: v61.47,123.19 61.47,121.41 LED18.A
N$64  (via drill 0.61)
  Top 0.254: v49.28,123.19 49.28,121.41 R34.1
  Bottom 0.254: v49.28,123.19 49.28,121.41 LED19.A
N$65  (via drill 0.61)
  Top 0.254: v36.83,123.19 36.83,121.41 R35.1
  Bottom 0.254: v36.83,123.19 36.83,121.41 LED20.A
N$66  (via drill 0.61)
  Top 0.254: R36.2 v19.81,120.14
  Bottom 0.254: v19.81,120.14 21.08,121.41 LED24.C
N$67  (via drill 0.61)
  Top 0.254: v10.41,119.89 10.41,120.14 12.7,122.43 R37.2
  Bottom 0.254: v10.41,119.89 8.89,121.41 LED21.C
N$68  (via drill 0.61)
  Top 0.254: v7.37,106.93 7.37,105.41 R38.2
  Bottom 0.254: v7.37,106.93 8.38,107.95 LED22.C
N$69  (via drill 0.61)
  Top 0.254: v20.07,107.7 R39.2
  Bottom 0.254: v20.07,107.7 LED23.C
N$70  (via drill 0.61)
  Top 0.254: v64.77,117.6 62.99,117.6 IC7.15
  Bottom 0.254: v64.77,117.6 70.36,117.6 74.17,121.41 LED17.C
N$71  (via drill 0.61)
  Top 0.254: v57.15,120.9 56.64,120.4 56.64,118.87 IC7.1
  Bottom 0.254: v57.15,120.9 58.17,120.9 58.67,121.41 LED18.C
N$72  (via drill 0.61)
  Top 0.254: v54.36,118.87 55.63,117.6 56.39,117.6 IC7.2
  Bottom 0.254: v54.36,118.87 49.02,118.87 46.48,121.41 LED19.C
N$73  (via drill 0.61)
  Top 0.254: v54.61,116.84 55.12,116.84 55.63,116.33 56.39,116.33 IC7.3
  Bottom 0.254: v54.61,116.84 38.61,116.84 34.04,121.41 LED20.C
N$74  (via drill 0.61)
  Top 0.254: v54.61,115.32 56.39,115.32 56.39,115.06 IC7.4
  Bottom 0.254: v54.61,115.32 54.36,115.57 39.12,115.57 36.32,118.36 27.43,118.36 24.38,121.41 LED24.A
N$75  (via drill 0.61)
  Top 0.254: v50.55,117.86 54.61,113.79 56.39,113.79 IC7.5
  Bottom 0.254: v50.55,117.86 47.5,117.86 41.15,124.21 36.32,124.21 35.05,122.94 13.46,122.94 11.94,121.41 LED21.A
N$76  (via drill 0.61)
  Top 0.254: v58.17,102.11 58.42,102.36 58.42,111.25 57.4,112.27 56.64,112.27 IC7.6
  Bottom 0.254: v58.17,102.11 57.4,102.11 56.39,103.12 27.94,103.12 27.43,102.62 11.94,102.62 11.94,107.95 LED22.A
N$77  (via drill 0.61)
  Top 0.254: v54.61,111 56.39,111 IC7.7
  Bottom 0.254: v54.61,111 27.94,111 24.64,107.7 LED23.A
N$78  (via drill 0.61)
  Top 0.254: v69.6,116.33 62.99,116.33 IC7.14 | v134.62,127.25 130.81,131.06 130.81,132.33 IC6.9
  Bottom 0.254: v69.6,116.33 70.36,117.09 88.65,117.09 96.77,125.22 132.59,125.22 v134.62,127.25
N$79  (via drill 0.61)
  Top 0.254: v36.32,106.17 36.32,107.7 R40.1
  Bottom 0.254: v36.32,106.17 36.32,107.95 LED25.A
N$80  (via drill 0.61)
  Top 0.254: R41.1 v50.8,107.95
  Bottom 0.254: v50.8,107.95 LED26.A
N$81  (via drill 0.61)
  Top 0.254: R42.1 v63.25,107.95
  Bottom 0.254: v63.25,107.95 LED27.A
N$82  (via drill 0.61)
  Top 0.254: R43.1 v75.95,107.95
  Bottom 0.254: v75.95,107.95 LED28.A
N$83  (via drill 0.61)
  Top 0.254: R44.2 v82.04,107.95
  Bottom 0.254: v82.04,107.95 LED32.C
N$84  (via drill 0.61)
  Top 0.254: R45.2 v94.49,107.95
  Bottom 0.254: v94.49,107.95 LED29.C
N$85  (via drill 0.61)
  Top 0.254: R46.2 v106.93,107.95
  Bottom 0.254: v106.93,107.95 LED30.C
N$86  (via drill 0.61)
  Top 0.254: v121.41,106.17 121.41,107.95 R47.2
  Bottom 0.254: v121.41,106.17 121.41,107.95 LED31.C
N$87  (via drill 0.61)
  Top 0.254: v86.87,104.9 96.77,114.81 v96.77,117.6 | v122.68,116.59 122.94,116.84 122.94,118.62 IC8.15
  Bottom 0.254: v86.87,104.9 34.04,104.9 34.04,107.95 LED25.C | v96.77,117.6 121.67,117.6 v122.68,116.59
N$88  (via drill 0.61)
  Top 0.254: v89.66,110.49 v95.76,116.59 | v121.16,116.59 121.67,116.08 121.67,112.52 IC8.1
  Bottom 0.254: v89.66,110.49 89.41,110.74 73.91,110.74 73.15,109.98 48.51,109.98 46.48,107.95 LED26.C | v95.76,116.59 v121.16,116.59
N$89  (via drill 0.61)
  Top 0.254: v64.77,106.17 77.72,93.22 v77.72,91.69 | v119.13,95.25 119.89,96.01 119.89,108.46 122.94,111.51 122.94,112.27 IC8.2
  Bottom 0.254: v64.77,106.17 60.71,106.17 58.93,107.95 LED27.C | v77.72,91.69 77.98,91.44 115.32,91.44 v119.13,95.25
N$90  (via drill 0.61)
  Top 0.254: v93.47,105.92 v96.77,102.62 | v120.9,102.62 124.21,105.92 124.21,112.27 IC8.3
  Bottom 0.254: v93.47,105.92 73.66,105.92 71.63,107.95 LED28.C | v96.77,102.62 v120.9,102.62
N$91  (via drill 0.61)
  Top 0.254: v123.95,104.14 125.48,105.66 125.48,112.27 IC8.4
  Bottom 0.254: v123.95,104.14 97.54,104.14 94.74,106.93 87.63,106.93 86.61,107.95 LED32.A
N$92  (via drill 0.61)
  Top 0.254: v130.05,114.3 127,114.3 127,112.52 IC8.5
  Bottom 0.254: v130.05,114.3 126.75,111 102.11,111 99.06,107.95 LED29.A
N$93  (via drill 0.61)
  Top 0.254: v126.75,105.16 127,105.41 127,110.49 128.02,111.51 128.02,112.27 IC8.6
  Bottom 0.254: v126.75,105.16 114.3,105.16 111.51,107.95 LED30.A
N$94  (via drill 0.61)
  Top 0.254: v128.02,108.71 129.29,109.98 129.29,112.27 IC8.7
  Bottom 0.254: v128.02,108.71 124.97,108.71 124.21,107.95 LED31.A
N$95  (via drill 0.61)
  Top 0.254: v71.12,116.08 71.12,109.98 62.99,109.98 IC7.9 | v122.68,114.55 124.21,116.08 124.21,118.62 IC8.14
  Bottom 0.254: v71.12,116.08 71.63,115.57 114.55,115.57 115.57,114.55 v122.68,114.55
N$96  (via drill 0.61)
  Top 0.254: v135.64,106.17 135.64,107.7 135.89,107.95 R48.1
  Bottom 0.254: v135.64,106.17 135.64,107.95 LED33.A
N$97  (via drill 0.61)
  Top 0.254: v136.14,95.25 136.14,93.47 R49.1
  Bottom 0.254: v136.14,95.25 136.14,93.47 LED34.A
N$98  (via drill 0.61)
  Top 0.254: R50.1 v125.73,93.47
  Bottom 0.254: v125.73,93.47 LED35.A
N$99  (via drill 0.61)
  Top 0.254: v109.98,95 109.98,93.73 109.73,93.47 R51.1
  Bottom 0.254: v109.98,95 111.51,93.47 LED36.A
N$100  (via drill 0.61)
  Top 0.254: R52.2 v94.49,93.47
  Bottom 0.254: v94.49,93.47 LED40.C
N$101  (via drill 0.61)
  Top 0.254: R53.2 v82.04,93.47
  Bottom 0.254: v82.04,93.47 LED37.C
N$102  (via drill 0.61)
  Top 0.254: v72.9,95 72.9,93.73 73.15,93.47 R54.2
  Bottom 0.254: v72.9,95 71.37,93.47 LED38.C
N$103  (via drill 0.61)
  Top 0.254: v58.93,95.25 58.93,93.47 R55.2
  Bottom 0.254: v58.93,95.25 58.93,93.47 LED39.C
N$104  (via drill 0.61)
  Top 0.254: v128.27,103.63 128.27,98.81 129.03,98.04 131.06,98.04 IC9.15
  Bottom 0.254: v128.27,103.63 128.78,103.63 133.1,107.95 LED33.C
N$105  (via drill 0.61)
  Top 0.254: v135.89,91.69 137.41,93.22 137.41,96.52 IC9.1
  Bottom 0.254: v135.89,91.69 135.13,91.69 133.35,93.47 LED34.C
N$106  (via drill 0.61)
  Top 0.254: v122.43,95.25 v124.46,97.28 | v135.38,97.54 137.41,97.54 137.41,97.79 IC9.2
  Bottom 0.254: v122.43,95.25 121.41,95.25 121.41,93.47 LED35.C | v124.46,97.28 124.71,97.54 v135.38,97.54
N$107  (via drill 0.61)
  Top 0.254: v139.45,96.52 138.94,97.03 138.94,98.55 138.43,99.06 137.67,99.06 IC9.3
  Bottom 0.254: v139.45,96.52 134.11,96.52 133.86,96.27 108.71,96.27 108.71,93.47 LED36.C
N$108  (via drill 0.61)
  Top 0.254: v135.38,101.85 136.65,100.58 137.41,100.58 IC9.4
  Bottom 0.254: v135.38,101.85 128.78,101.85 128.52,101.6 107.19,101.6 99.06,93.47 LED40.A
N$109  (via drill 0.61)
  Top 0.254: v139.45,102.11 137.67,102.11 137.67,101.85 IC9.5
  Bottom 0.254: v139.45,102.11 138.68,102.87 134.87,102.87 134.62,102.62 123.7,102.62 122.68,103.63 95.76,103.63 95.76,102.62 86.61,93.47 LED37.A
N$110  (via drill 0.61)
  Top 0.254: v139.95,98.3 140.46,98.81 140.46,102.62 139.95,103.12 137.67,103.12 IC9.6
  Bottom 0.254: v139.95,98.3 139.7,98.55 134.87,98.55 134.62,98.3 109.98,98.3 103.63,91.95 82.04,91.95 81.28,92.71 75.18,92.71 74.42,93.47 LED38.A
N$111  (via drill 0.61)
  Top 0.254: v134.62,95.5 134.37,95.76 134.37,102.36 136.14,104.14 137.41,104.14 IC9.7
  Bottom 0.254: v134.62,95.5 132.84,95.5 128.02,90.68 64.52,90.68 61.72,93.47 LED39.A
N$112  (via drill 0.61)
  Top 0.254: v133.35,106.17 133.35,116.08 130.81,118.62 IC8.9 | v129.29,99.31 131.06,99.31 IC9.14
  Bottom 0.254: v133.35,106.17 136.14,103.38 139.7,103.38 140.46,102.62 140.46,99.31 v129.29,99.31
N$113  (via drill 0.61)
  Top 0.254: R56.1 v50.8,93.47
  Bottom 0.254: v50.8,93.47 LED41.A
N$114  (via drill 0.61)
  Top 0.254: R57.1 v38.35,93.47
  Bottom 0.254: v38.35,93.47 LED42.A
N$115  (via drill 0.61)
  Top 0.254: R58.1 v25.91,93.47
  Bottom 0.254: v25.91,93.47 LED43.A
N$116  (via drill 0.61)
  Top 0.254: R59.1 v13.46,93.47
  Bottom 0.254: v13.46,93.47 LED44.A
N$117  (via drill 0.61)
  Top 0.254: v8.89,81.79 8.89,80.01 R60.2
  Bottom 0.254: v8.89,81.79 8.89,80.01 LED48.C
N$118  (via drill 0.61)
  Top 0.254: v21.59,78.23 21.59,80.01 R61.2
  Bottom 0.254: v21.59,78.23 21.59,80.01 LED45.C
N$119  (via drill 0.61)
  Top 0.254: v32.26,80.01 R62.2
  Bottom 0.254: v32.26,80.01 LED46.C
N$120  (via drill 0.61)
  Top 0.254: v46.48,78.23 46.48,80.01 R63.2
  Bottom 0.254: v46.48,78.23 46.48,80.01 LED47.C
N$121  (via drill 0.61)
  Top 0.254: v42.16,91.95 41.15,90.93 41.15,90.17 IC10.15
  Bottom 0.254: v42.16,91.95 44.7,91.95 46.23,93.47 LED41.C
N$122  (via drill 0.61)
  Top 0.254: v39.37,85.85 39.62,85.6 39.62,83.82 IC10.1
  Bottom 0.254: v39.37,85.85 39.37,88.14 34.04,93.47 LED42.C
N$123  (via drill 0.61)
  Top 0.254: v38.61,82.8 39.12,82.3 40.89,82.3 40.89,83.57 IC10.2